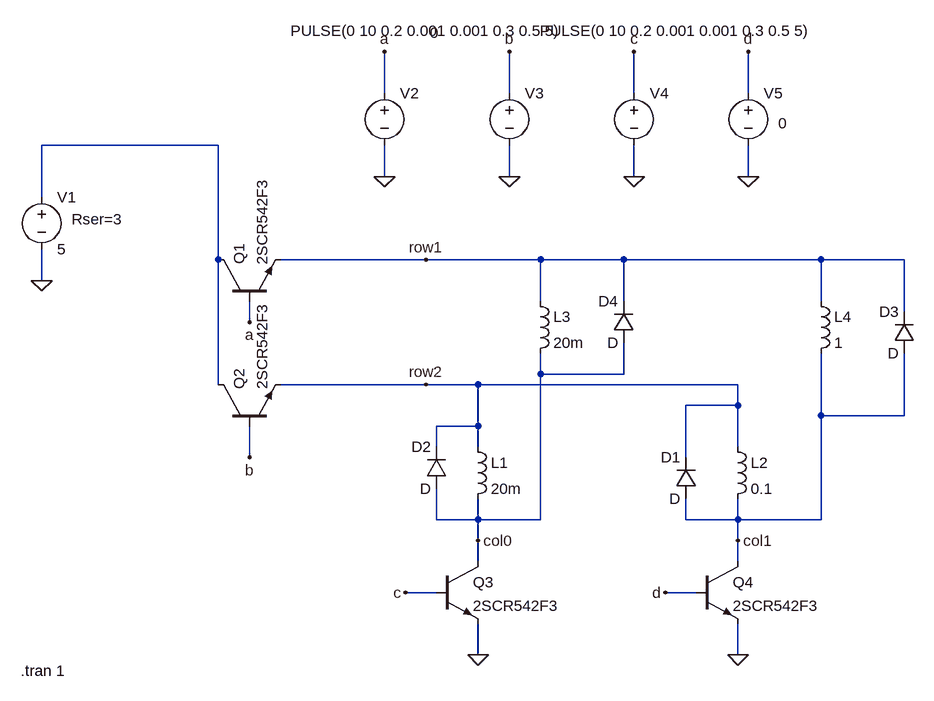
[diagram p0: schematic flyback_diodes2.asc]
flyback_diodes2.asc, the LTspice schematic file:
Version 4
SHEET 1 1624 680
WIRE 64 -656 64 -720
WIRE 256 -656 256 -720
WIRE 448 -656 448 -720
WIRE 624 -656 624 -720
WIRE -192 -576 -464 -576
WIRE 64 -528 64 -576
WIRE 256 -528 256 -576
WIRE 448 -528 448 -576
WIRE 624 -528 624 -576
WIRE -464 -496 -464 -576
WIRE -192 -400 -192 -576
WIRE 128 -400 -96 -400
WIRE 304 -400 128 -400
WIRE 432 -400 304 -400
WIRE 736 -400 432 -400
WIRE 864 -400 736 -400
WIRE -464 -368 -464 -416
WIRE 304 -336 304 -400
WIRE 432 -336 432 -400
WIRE 736 -336 736 -400
WIRE 864 -320 864 -400
WIRE -144 -304 -144 -336
WIRE 304 -224 304 -256
WIRE 432 -224 432 -272
WIRE 432 -224 304 -224
WIRE -192 -208 -192 -400
WIRE 128 -208 -96 -208
WIRE 208 -208 128 -208
WIRE 608 -208 208 -208
WIRE 608 -176 608 -208
WIRE 608 -176 528 -176
WIRE 736 -160 736 -256
WIRE 864 -160 864 -256
WIRE 864 -160 736 -160
WIRE 208 -144 208 -208
WIRE 208 -144 144 -144
WIRE 144 -112 144 -144
WIRE 208 -112 208 -144
WIRE 608 -112 608 -176
WIRE -144 -96 -144 -144
WIRE 528 -96 528 -176
WIRE 144 0 144 -48
WIRE 208 0 208 -32
WIRE 208 0 144 0
WIRE 304 0 304 -224
WIRE 304 0 208 0
WIRE 528 0 528 -32
WIRE 608 0 608 -32
WIRE 608 0 528 0
WIRE 736 0 736 -160
WIRE 736 0 608 0
WIRE 208 32 208 0
WIRE 608 32 608 0
WIRE 208 64 208 32
WIRE 608 64 608 32
WIRE 144 112 96 112
WIRE 544 112 496 112
WIRE 208 208 208 160
WIRE 608 208 608 160
FLAG 208 208 0
FLAG 608 208 0
FLAG 208 32 col0
FLAG 608 32 col1
FLAG 128 -400 row1
FLAG 128 -208 row2
FLAG -144 -304 a
FLAG -144 -96 b
FLAG 96 112 c
FLAG 496 112 d
FLAG -464 -368 0
FLAG 64 -528 0
FLAG 256 -528 0
FLAG 448 -528 0
FLAG 624 -528 0
FLAG 64 -720 a
FLAG 256 -720 b
FLAG 448 -720 c
FLAG 624 -720 d
SYMBOL ind 192 -128 R0
SYMATTR InstName L1
SYMATTR Value 20m
SYMATTR SpiceLine Ipk=3 Rser=5
SYMBOL ind 592 -128 R0
SYMATTR InstName L2
SYMATTR Value 0.1
SYMATTR SpiceLine Ipk=3 Rser=0.1
SYMBOL ind 288 -352 R0
SYMATTR InstName L3
SYMATTR Value 20m
SYMATTR SpiceLine Ipk=0.069 Rser=5 Rpar=0 Cpar=0
SYMBOL ind 720 -352 R0
SYMATTR InstName L4
SYMATTR Value 1
SYMATTR SpiceLine Ipk=3 Rser=0.1
SYMBOL voltage -464 -512 R0
WINDOW 123 0 0 Left 0
WINDOW 39 46 50 Left 2
SYMATTR InstName V1
SYMATTR Value 5
SYMATTR SpiceLine Rser=3
SYMBOL voltage 64 -672 R0
WINDOW 3 -145 -80 Left 2
WINDOW 123 0 0 Left 0
WINDOW 39 0 0 Left 0
SYMATTR InstName V2
SYMATTR Value PULSE(0 10 0.2 0.001 0.001 0.3 0.5 5)
SYMBOL voltage 624 -672 R0
WINDOW 3 46 62 Left 2
WINDOW 123 0 0 Left 0
WINDOW 39 0 0 Left 0
SYMATTR InstName V5
SYMATTR Value 0
SYMBOL voltage 256 -672 R0
WINDOW 3 -122 -77 Left 2
WINDOW 123 0 0 Left 0
WINDOW 39 0 0 Left 0
SYMATTR InstName V3
SYMATTR Value 0
SYMBOL voltage 448 -672 R0
WINDOW 3 -145 -80 Left 2
WINDOW 123 0 0 Left 0
WINDOW 39 0 0 Left 0
SYMATTR InstName V4
SYMATTR Value PULSE(0 10 0.2 0.001 0.001 0.3 0.5 5)
SYMBOL npn -192 -336 R270
SYMATTR InstName Q1
SYMATTR Value 2SCR542F3
SYMBOL npn -192 -144 R270
SYMATTR InstName Q2
SYMATTR Value 2SCR542F3
SYMBOL npn 144 64 R0
SYMATTR InstName Q3
SYMATTR Value 2SCR542F3
SYMBOL npn 544 64 R0
SYMATTR InstName Q4
SYMATTR Value 2SCR542F3
SYMBOL diode 544 -32 R180
WINDOW 0 24 64 Left 2
WINDOW 3 24 0 Left 2
SYMATTR InstName D1
SYMBOL diode 160 -48 R180
WINDOW 0 24 64 Left 2
WINDOW 3 24 0 Left 2
SYMATTR InstName D2
SYMBOL diode 880 -256 R180
WINDOW 0 24 64 Left 2
WINDOW 3 24 0 Left 2
SYMATTR InstName D3
SYMBOL diode 448 -272 R180
WINDOW 0 24 64 Left 2
WINDOW 3 24 0 Left 2
SYMATTR InstName D4
TEXT -496 232 Left 2 !.tran 1

The netlist it stands for:
* flyback_diodes2.asc
L1 row2 col0 20m Ipk=3 Rser=5
L2 row2 col1 0.1 Ipk=3 Rser=0.1
L3 row1 col0 20m Ipk=0.069 Rser=5 Rpar=0 Cpar=0
L4 row1 col1 1 Ipk=3 Rser=0.1
V1 N001 0 5 Rser=3
V2 a 0 PULSE(0 10 0.2 0.001 0.001 0.3 0.5 5)
V5 d 0 0
V3 b 0 0
V4 c 0 PULSE(0 10 0.2 0.001 0.001 0.3 0.5 5)
Q1 N001 a row1 0 2SCR542F3
Q2 N001 b row2 0 2SCR542F3
Q3 col0 c 0 0 2SCR542F3
Q4 col1 d 0 0 2SCR542F3
D1 col1 row2 D
D2 col0 row2 D
D3 col1 row1 D
D4 col0 row1 D
.model D D
.lib standard.dio
.model NPN NPN
.model PNP PNP
.lib standard.bjt
.tran 1
.backanno
.end